# EAGLE schematic Schematic (EAGLE 9.7.0)
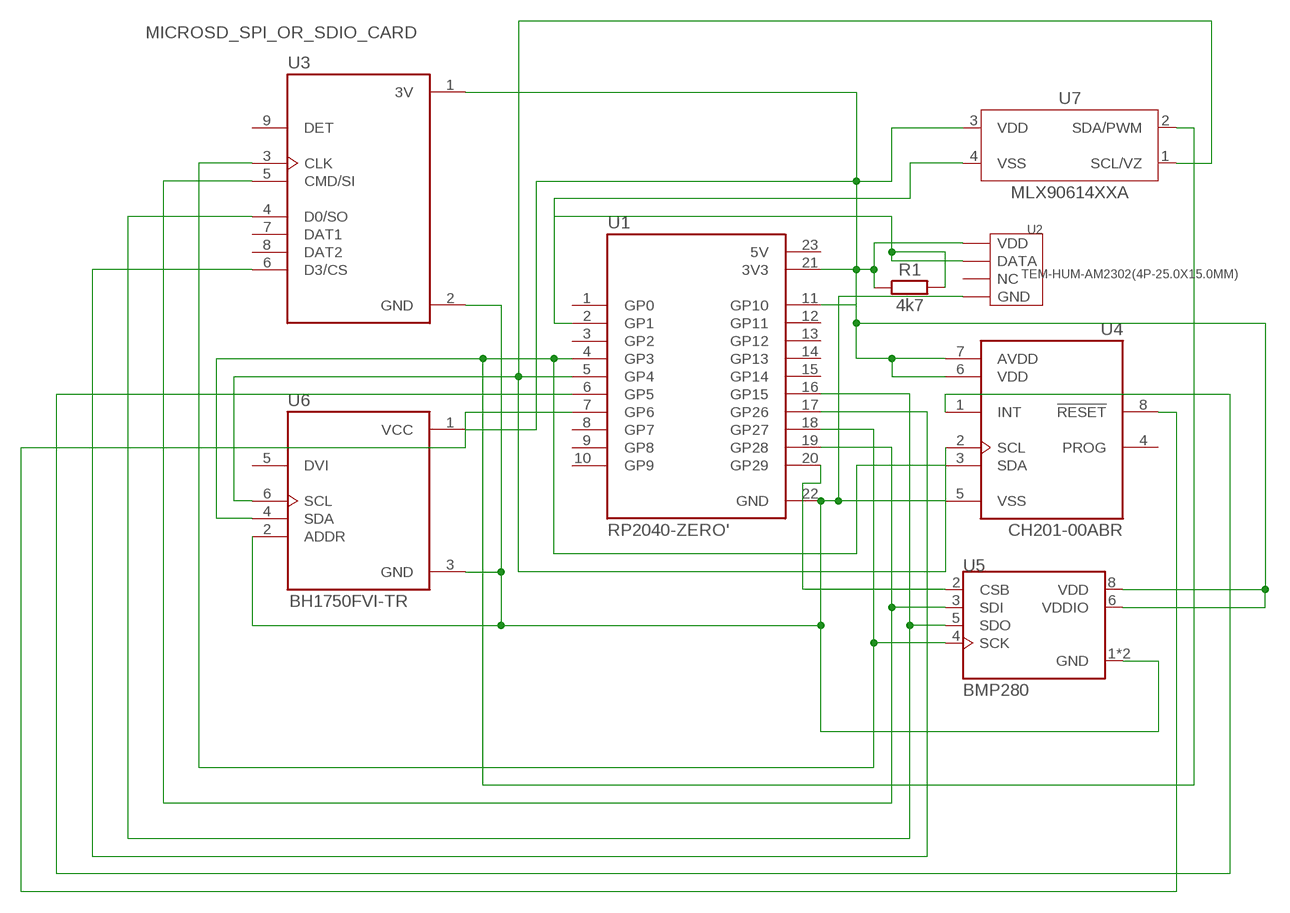
[diagram p0: schematic, sheet 1]

## Parts
R1  4k7  RESISTOR__CHIP-0402(1005-METRIC)  [RESC1005X40]
U1  RP2040-ZERO'  [MODULE_RP2040-ZERO]
U2  TEM-HUM-AM2302(4P-25.0X15.0MM)  [SNR4-2.54-25.0X15.0X7.0MM]
U3  MICROSD_SPI_OR_SDIO_CARD  [MODULE_MICROSD_SPI_OR_SDIO_CARD]
U4  CH201-00ABR  [XDCR_CH201-00ABR]
U5  BMP280  [XDCR_BMP280]
U6  BH1750FVI-TR  [XDCR_BH1750FVI-TR]
U7  MLX90614XXA  [MLX90614XXA]

## Nets
GND: U1.22(GND) U2.P$4(GND) U3.2(GND) U4.5(VSS) U5.1(GND) U5.7(GND) U6.2(ADDR) U6.3(GND)
N$1: R1.2 U2.P$2(DATA)
N$2: U1.6(GP5) U4.1(INT)
N$3: U1.7(GP6) U4.8(!RESET)
N$4: U1.18(GP27) U3.3(CLK) U5.4(SCK)
N$5: U1.19(GP28) U3.5(CMD/SI) U5.3(SDI)
N$6: U1.16(GP15) U3.4(D0/SO) U5.5(SDO)
N$7: U1.17(GP26) U3.6(D3/CS)
N$8: R1.1 U1.11(GP10) U1.21(3V3) U2.P$1(VDD) U3.1(3V) U4.6(VDD) U4.7(AVDD) U5.6(VDDIO) U5.8(VDD) U6.1(VCC) U7.3(VDD)
N$9: U1.5(GP4) U4.2(SCL) U6.6(SCL) U7.1(SCL/VZ)
N$10: U1.2(GP1) U7.4(VSS)
N$11: U1.4(GP3) U4.3(SDA) U6.4(SDA) U7.2(SDA/PWM)
N$12: U1.20(GP29) U5.2(CSB)
Unconnected: U1.1(GP0) U1.3(GP2) U1.8(GP7) U1.9(GP8) U1.10(GP9) U1.12(GP11) U1.13(GP12) U1.14(GP13) U1.15(GP14) U2.P$3(NC) U3.7(DAT1) U3.8(DAT2) U3.9(DET) U4.4(PROG) U6.5(DVI)

## Power pins joined to a net without a drawn wire
5V: U1.23(5V)

## Library data of the parts
R1 = Tinkercad:RESISTOR: Resistor Fixed - Generic; CATEGORY: Resistor; SUB-CATEGORY: Fixed
U1 = RP2040-ZERO:RP2040-ZERO: Check availability <https://pricing.snapeda.com/parts/RP2040-ZERO/Waveshare%20Electronics/view-part?ref=eda>; AVAILABILITY: Not in stock; CHECK_PRICES: https://www.snapeda.com/parts/RP2040-ZERO/Waveshare+Electronics/view-part/?ref=eda; DESCRIPTION: Low-Cost, High-Performance Pico-Like MCU Board Based On Raspberry Pi Microcontroller RP2040; MF: Waveshare Electronics; MP: RP2040-ZERO; PACKAGE: Package; PRICE: None; SNAPEDA_LINK: https://www.snapeda.com/parts/RP2040-ZERO/Waveshare+Electronics/view-part/?ref=snap
U2 = TEM-HUM-AM2302_4P-25.0X15.0MM_:TEM-HUM-AM2302(4P-25.0X15.0MM): Check availability <https://pricing.snapeda.com/parts/AM2302/MCM%20Electronics/view-part?ref=eda>; AVAILABILITY: Not in stock; CHECK_PRICES: https://www.snapeda.com/parts/AM2302/MCM+Electronics/view-part/?ref=eda; DESCRIPTION: AM2302/DHT22 Humidity, Temperature Sensor mikroBUS™ Click™ Platform Evaluation Expansion Board; MF: MCM Electronics; MP: AM2302; PACKAGE: Housed Sensor Seeed Technology; PRICE: None; SNAPEDA_LINK: https://www.snapeda.com/parts/AM2302/MCM+Electronics/view-part/?ref=snap
U3 = MICROSD_SPI_OR_SDIO_CARD:MICROSD_SPI_OR_SDIO_CARD: Check availability <https://pricing.snapeda.com/parts/MicroSD%20SPI%20or%20SDIO%20Card/Adafruit%20Industries/view-part?ref=eda>; AVAILABILITY: Not in stock; CHECK_PRICES: https://www.snapeda.com/parts/MicroSD%20SPI%20or%20SDIO%20Card/Adafruit+Industries/view-part/?ref=eda; DESCRIPTION: Memory Card Connectors Raspberry pi microSD card adapter; MF: Adafruit Industries; MP: MicroSD SPI or SDIO Card; PACKAGE: Package; PRICE: None; SNAPEDA_LINK: https://www.snapeda.com/parts/MicroSD%20SPI%20or%20SDIO%20Card/Adafruit+Industries/view-part/?ref=snap
U4 = CH201-00ABR:CH201-00ABR: Check availability <https://pricing.snapeda.com/parts/CH201-00ABR/InvenSense/view-part?ref=eda>; AVAILABILITY: In Stock; CHECK_PRICES: https://www.snapeda.com/parts/CH201-00ABR/InvenSense/view-part/?ref=eda; DESCRIPTION: MEMS Ultra-low-power ultrasonic ToF (Time of Flight) range sensor in 3.5mm size.; MF: InvenSense; MP: CH201-00ABR; PACKAGE: None; PRICE: None; SNAPEDA_LINK: https://www.snapeda.com/parts/CH201-00ABR/InvenSense/view-part/?ref=snap
U5 = BMP280:BMP280: Check availability <https://pricing.snapeda.com/parts/BMP280/Bosch/view-part?ref=eda>; AVAILABILITY: In Stock; CHECK_PRICES: https://www.snapeda.com/parts/BMP280/Bosch/view-part/?ref=eda; DESCRIPTION: Pressure Sensor 4.35PSI ~ 15.95PSI (30kPa ~ 110kPa) Absolute - 16b 8-SMD; MF: Bosch; MP: BMP280; PACKAGE: SMD-8 Bosch Sensortec; PRICE: None; SNAPEDA_LINK: https://www.snapeda.com/parts/BMP280/Bosch/view-part/?ref=snap
U6 = BH1750FVI-TR:BH1750FVI-TR: Check availability <https://pricing.snapeda.com/parts/BH1750FVI-TR/Rohm/view-part?ref=eda>; AVAILABILITY: In Stock; CHECK_PRICES: https://www.snapeda.com/parts/BH1750FVI-TR/Rohm/view-part/?ref=eda; DESCRIPTION: Optical Sensor Ambient 560nm I2C 6-SMD, Flat Lead Exposed Pad; MF: Rohm; MP: BH1750FVI-TR; PACKAGE: SMD-6 ROHM Semiconductor; PRICE: None; SNAPEDA_LINK: https://www.snapeda.com/parts/BH1750FVI-TR/Rohm/view-part/?ref=snap
U7 = Sensor:MLX90614X?: Single and Dual Zone Infra Red Thermometer in TO-39; CATEGORY: Sensors & Transducers; DATASHEET: https://www.melexis.com/-/media/files/documents/datasheets/mlx90614-datasheet-melexis.pdf; DESCRIPTION: Temperature Sensor Digital - Infrared (IR) -40°C ~ 85°C 16 b TO-39; MANUFACTURER: Melexis Technologies NV; MPN: MLX90614ESF-AAA-000-TU; OPERATING_TEMPERATURE: -40°C ~ 85°C; PACKAGE_SIZE: TO-39; PACKAGE_TYPE: THT; PART_STATUS: ACTIVE; ROHS: COMPLIANT; SERIES: MLX90614; SUBCATEGORY: Temperature Sensors; TYPE: Digital - Infrared (IR)